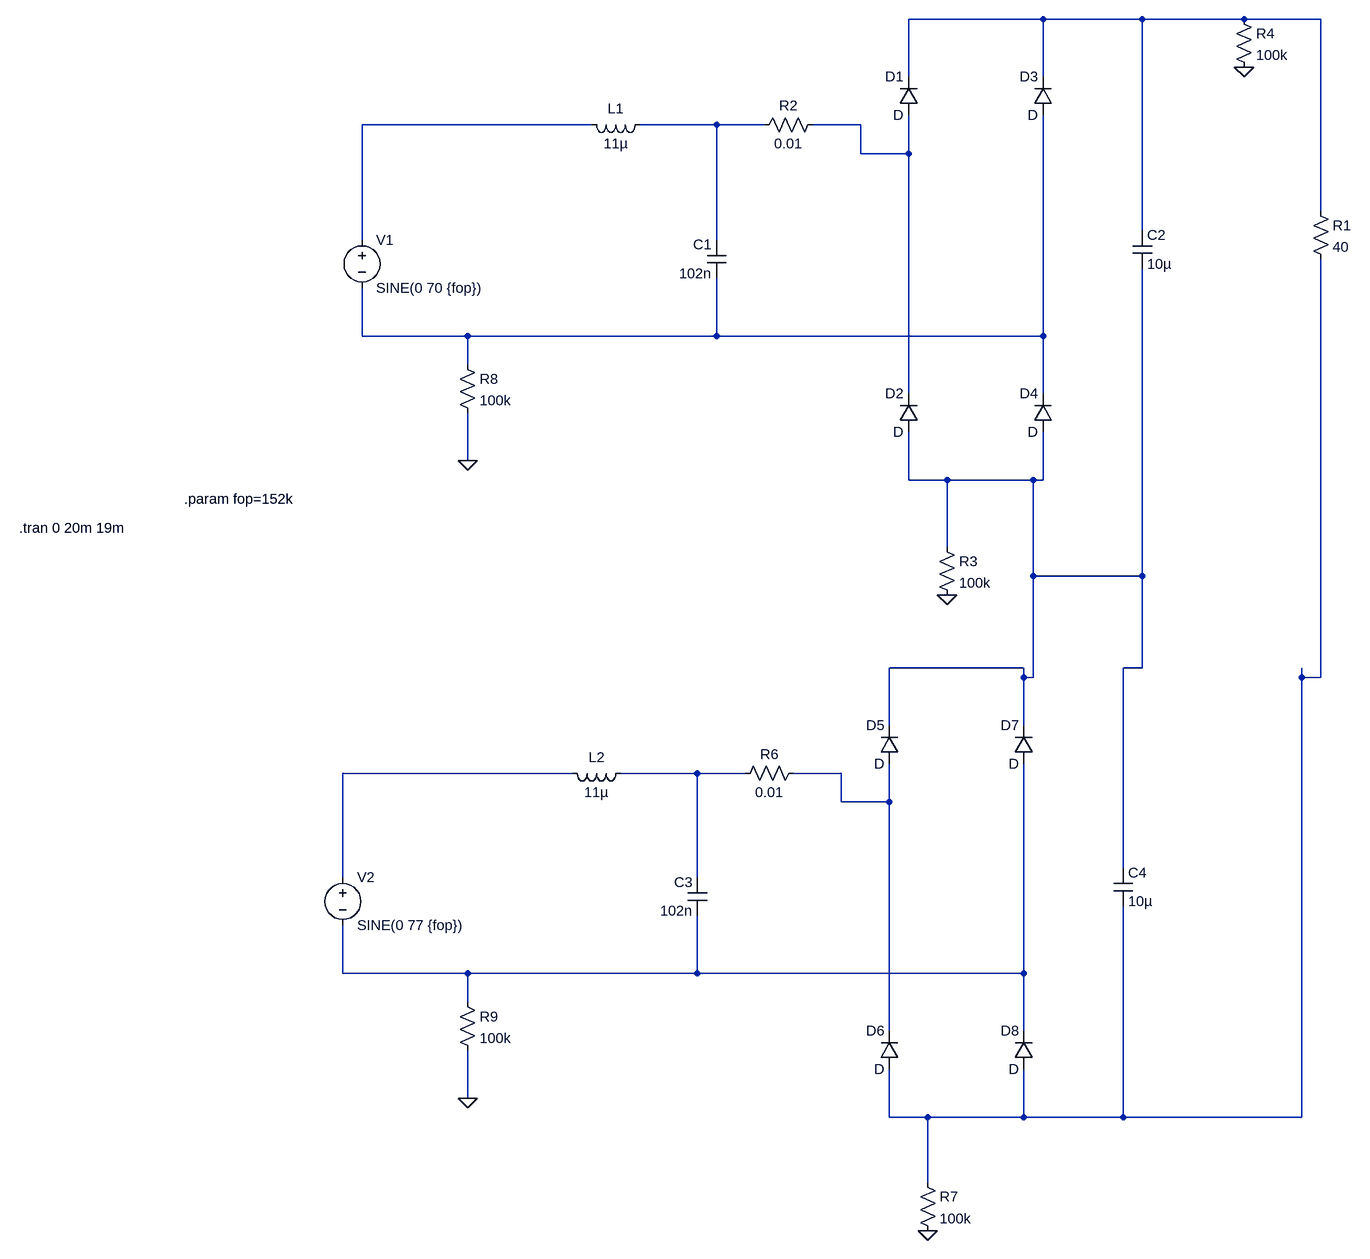
[diagram p0: schematic paralel-compensation-series.asc]
paralel-compensation-series.asc, the LTspice schematic file:
Version 4
SHEET 1 2752 1988
WIRE 1936 -240 1712 -240
WIRE 2240 -240 1936 -240
WIRE 2496 -240 2240 -240
WIRE 2624 -240 2496 -240
WIRE 1712 -144 1712 -240
WIRE 1936 -144 1936 -240
WIRE 1184 -64 736 -64
WIRE 1392 -64 1264 -64
WIRE 1472 -64 1392 -64
WIRE 1632 -64 1552 -64
WIRE 1632 -16 1632 -64
WIRE 1712 -16 1712 -80
WIRE 1712 -16 1632 -16
WIRE 2624 80 2624 -240
WIRE 2240 112 2240 -240
WIRE 736 128 736 -64
WIRE 1392 128 1392 -64
WIRE 736 288 736 208
WIRE 912 288 736 288
WIRE 1392 288 1392 192
WIRE 1392 288 912 288
WIRE 1936 288 1936 -80
WIRE 1936 288 1392 288
WIRE 912 336 912 288
WIRE 1712 384 1712 -16
WIRE 1936 384 1936 288
WIRE 912 496 912 416
WIRE 1712 528 1712 448
WIRE 1776 528 1712 528
WIRE 1920 528 1776 528
WIRE 1936 528 1936 448
WIRE 1936 528 1920 528
WIRE 1776 640 1776 528
WIRE 1920 688 1920 528
WIRE 2240 688 2240 176
WIRE 2240 688 1920 688
WIRE 1904 848 1680 848
WIRE 2240 848 2240 688
WIRE 2240 848 2208 848
WIRE 1904 864 1904 848
WIRE 1920 864 1920 688
WIRE 1920 864 1904 864
WIRE 2592 864 2592 848
WIRE 2624 864 2624 160
WIRE 2624 864 2592 864
WIRE 1680 944 1680 848
WIRE 1904 944 1904 864
WIRE 1152 1024 704 1024
WIRE 1360 1024 1232 1024
WIRE 1440 1024 1360 1024
WIRE 1600 1024 1520 1024
WIRE 1600 1072 1600 1024
WIRE 1680 1072 1680 1008
WIRE 1680 1072 1600 1072
WIRE 2208 1200 2208 848
WIRE 704 1216 704 1024
WIRE 1360 1216 1360 1024
WIRE 704 1376 704 1296
WIRE 912 1376 704 1376
WIRE 1360 1376 1360 1280
WIRE 1360 1376 912 1376
WIRE 1904 1376 1904 1008
WIRE 1904 1376 1360 1376
WIRE 912 1424 912 1376
WIRE 1680 1472 1680 1072
WIRE 1904 1472 1904 1376
WIRE 912 1584 912 1504
WIRE 1680 1616 1680 1536
WIRE 1744 1616 1680 1616
WIRE 1904 1616 1904 1536
WIRE 1904 1616 1744 1616
WIRE 2208 1616 2208 1264
WIRE 2208 1616 1904 1616
WIRE 2592 1616 2592 864
WIRE 2592 1616 2208 1616
WIRE 1744 1728 1744 1616
FLAG 1776 720 0
FLAG 2496 -160 0
FLAG 1744 1808 0
FLAG 912 496 0
FLAG 912 1584 0
SYMBOL voltage 736 112 R0
WINDOW 123 0 0 Left 0
WINDOW 39 0 0 Left 0
SYMATTR InstName V1
SYMATTR Value SINE(0 70 {fop})
SYMBOL ind 1280 -80 R90
WINDOW 0 5 56 VBottom 2
WINDOW 3 32 56 VTop 2
SYMATTR InstName L1
SYMATTR Value 11µ
SYMBOL cap 1408 192 R180
WINDOW 0 24 56 Left 2
WINDOW 3 24 8 Left 2
SYMATTR InstName C1
SYMATTR Value 102n
SYMBOL diode 1728 -80 R180
WINDOW 0 24 64 Left 2
WINDOW 3 24 0 Left 2
SYMATTR InstName D1
SYMBOL diode 1728 448 R180
WINDOW 0 24 64 Left 2
WINDOW 3 24 0 Left 2
SYMATTR InstName D2
SYMBOL diode 1952 -80 R180
WINDOW 0 24 64 Left 2
WINDOW 3 24 0 Left 2
SYMATTR InstName D3
SYMBOL diode 1952 448 R180
WINDOW 0 24 64 Left 2
WINDOW 3 24 0 Left 2
SYMATTR InstName D4
SYMBOL res 2608 64 R0
SYMATTR InstName R1
SYMATTR Value 40
SYMBOL res 1568 -80 R90
WINDOW 0 0 56 VBottom 2
WINDOW 3 32 56 VTop 2
SYMATTR InstName R2
SYMATTR Value 0.01
SYMBOL cap 2224 112 R0
SYMATTR InstName C2
SYMATTR Value 10µ
SYMBOL res 1760 624 R0
SYMATTR InstName R3
SYMATTR Value 100k
SYMBOL res 2480 -256 R0
SYMATTR InstName R4
SYMATTR Value 100k
SYMBOL voltage 704 1200 R0
WINDOW 123 0 0 Left 0
WINDOW 39 0 0 Left 0
SYMATTR InstName V2
SYMATTR Value SINE(0 77 {fop})
SYMBOL ind 1248 1008 R90
WINDOW 0 5 56 VBottom 2
WINDOW 3 32 56 VTop 2
SYMATTR InstName L2
SYMATTR Value 11µ
SYMBOL cap 1376 1280 R180
WINDOW 0 24 56 Left 2
WINDOW 3 24 8 Left 2
SYMATTR InstName C3
SYMATTR Value 102n
SYMBOL diode 1696 1008 R180
WINDOW 0 24 64 Left 2
WINDOW 3 24 0 Left 2
SYMATTR InstName D5
SYMBOL diode 1696 1536 R180
WINDOW 0 24 64 Left 2
WINDOW 3 24 0 Left 2
SYMATTR InstName D6
SYMBOL diode 1920 1008 R180
WINDOW 0 24 64 Left 2
WINDOW 3 24 0 Left 2
SYMATTR InstName D7
SYMBOL diode 1920 1536 R180
WINDOW 0 24 64 Left 2
WINDOW 3 24 0 Left 2
SYMATTR InstName D8
SYMBOL res 1536 1008 R90
WINDOW 0 0 56 VBottom 2
WINDOW 3 32 56 VTop 2
SYMATTR InstName R6
SYMATTR Value 0.01
SYMBOL cap 2192 1200 R0
SYMATTR InstName C4
SYMATTR Value 10µ
SYMBOL res 1728 1712 R0
SYMATTR InstName R7
SYMATTR Value 100k
SYMBOL res 896 320 R0
SYMATTR InstName R8
SYMATTR Value 100k
SYMBOL res 896 1408 R0
SYMATTR InstName R9
SYMATTR Value 100k
TEXT -752 608 Left 2 !.tran 0 20m 19m
TEXT 440 560 Left 2 !.param fop=152k

The netlist it stands for:
* paralel-compensation-series.asc
V1 N002 N005 SINE(0 70 {fop})
L1 N003 N002 11µ
C1 N005 N003 102n
D1 N004 N001 D
D2 N006 N004 D
D3 N005 N001 D
D4 N006 N005 D
R1 N001 N007 40
R2 N004 N003 0.01
C2 N001 N006 10µ
R3 N006 0 100k
R4 N001 0 100k
V2 N008 N011 SINE(0 77 {fop})
L2 N009 N008 11µ
C3 N011 N009 102n
D5 N010 N006 D
D6 N007 N010 D
D7 N011 N006 D
D8 N007 N011 D
R6 N010 N009 0.01
C4 N006 N007 10µ
R7 N007 0 100k
R8 N005 0 100k
R9 N011 0 100k
.model D D
.lib standard.dio
.tran 0 20m 19m
.param fop=152k
.backanno
.end